# EAGLE design rly410 (EAGLE 6.5.0)
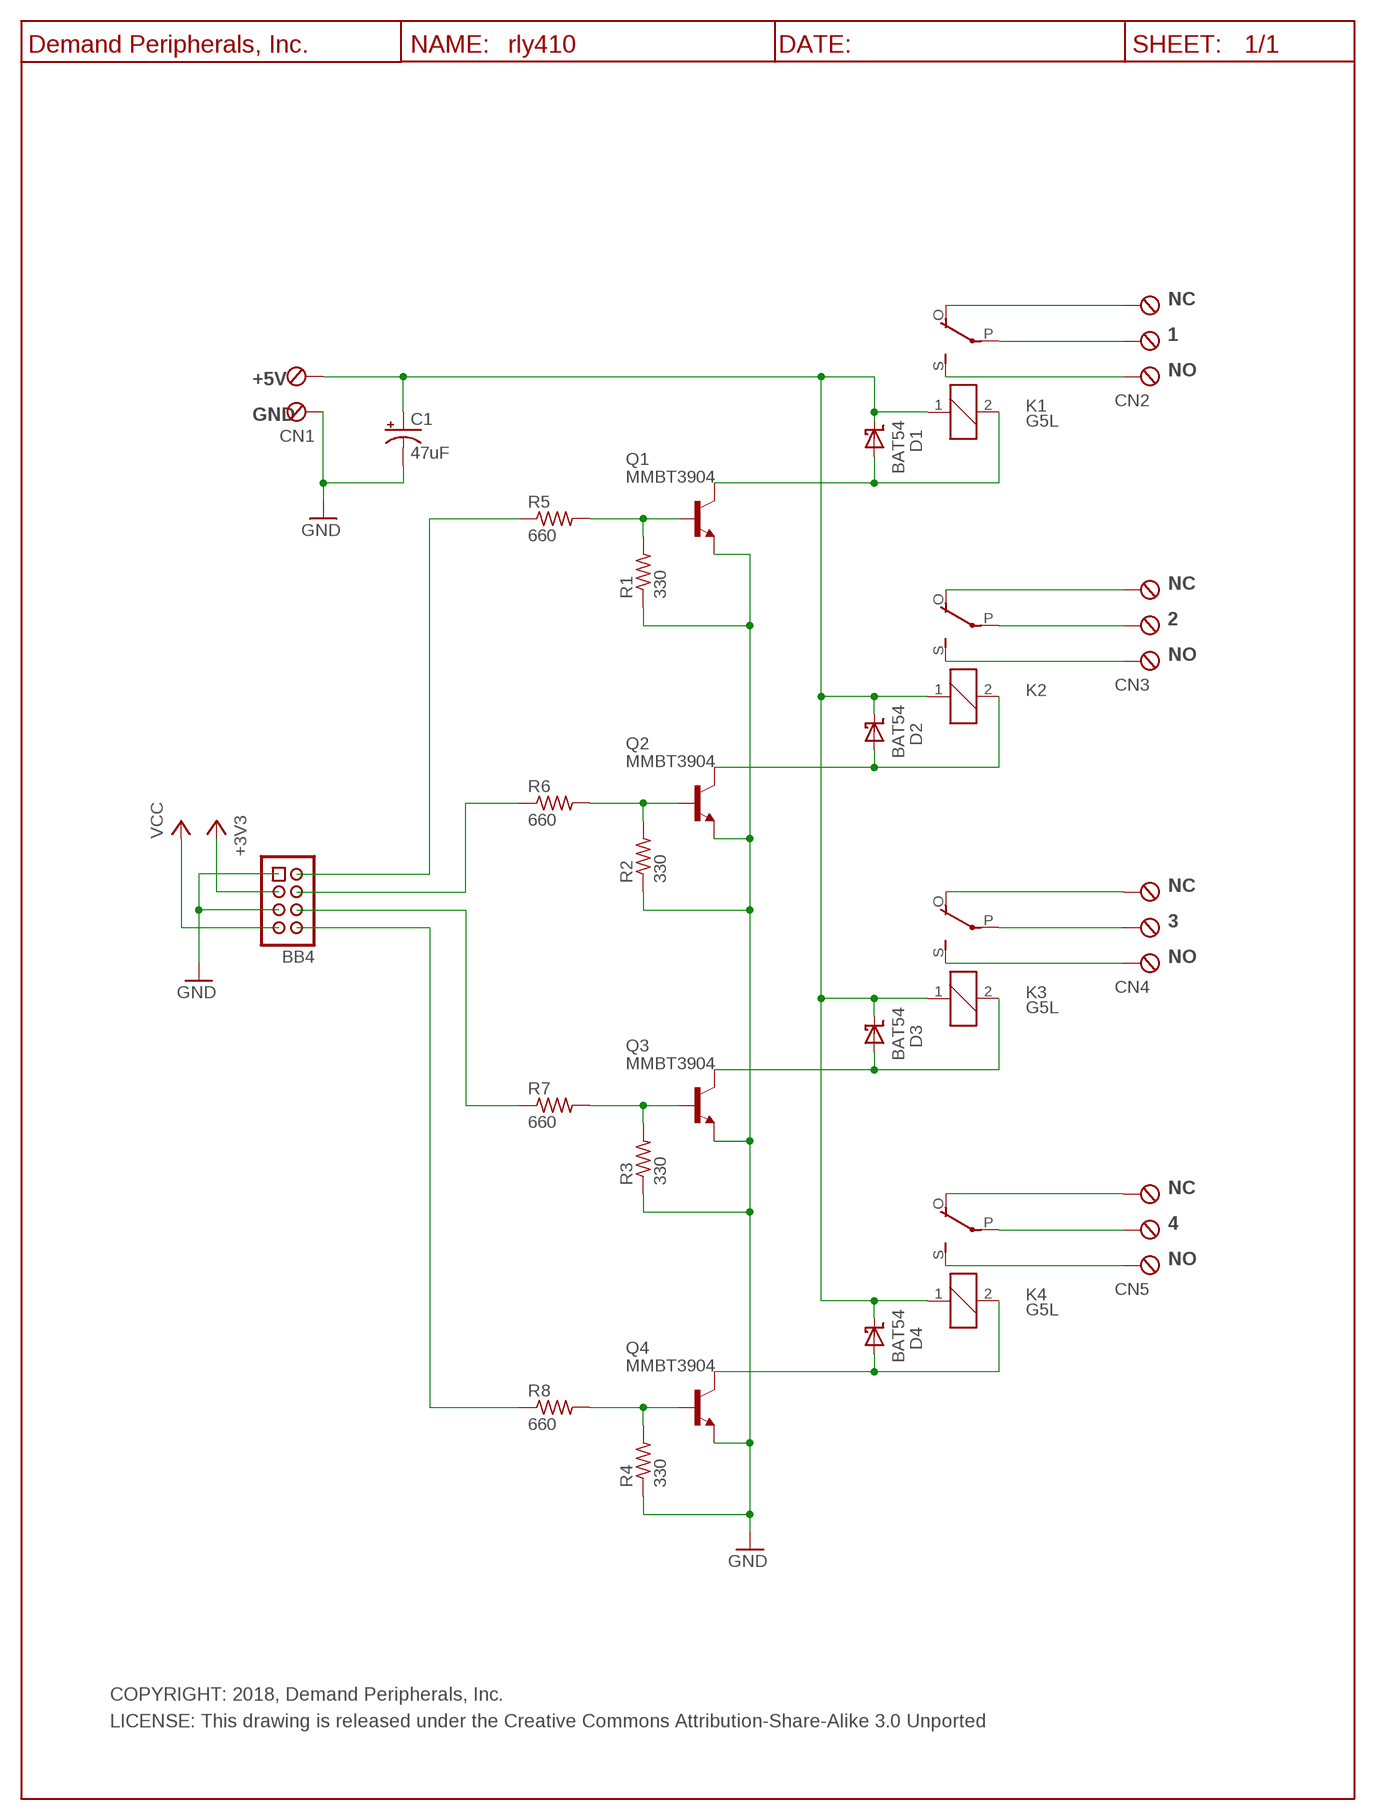
[diagram p0: schematic, sheet 1]

## Parts
BB4  Keyed_Pin_Header_4x2(0.1"x0.1")  HDR-4X2-SHR  [HDR-4X2]
C1  47uF  C100UF_E3.5-8  [E3.5-8]
CN1  TBLK-5.08-X2  [TBLK-5.08-X2]
CN2  TBLK-5.08-X3  [TBLK-5.08-X3]
CN3  TBLK-5.08-X3  [TBLK-5.08-X3]
CN4  TBLK-5.08-X3  [TBLK-5.08-X3]
CN5  TBLK-5.08-X3  [TBLK-5.08-X3]
D1  BAT54  [SOT23]
D2  BAT54  [SOT23]
D3  BAT54  [SOT23]
D4  BAT54  [SOT23]
K1  G5L  [G5LE]
K2  G5L  [G5LE]
K3  G5L  [G5LE]
K4  G5L  [G5LE]
Q1  MMBT3904  [SOT23]
Q2  MMBT3904  [SOT23]
Q3  MMBT3904  [SOT23]
Q4  MMBT3904  [SOT23]
R1  330  R360_R0603  [R0603]
R2  330  R360_R0603  [R0603]
R3  330  R360_R0603  [R0603]
R4  330  R360_R0603  [R0603]
R5  660  R660_R0603  [R0603]
R6  660  R660_R0603  [R0603]
R7  660  R660_R0603  [R0603]
R8  660  R660_R0603  [R0603]
U$1  DP_FRAME_P  [P_FRAME]

## Nets
+3V3: BB4.3
GND: BB4.1 BB4.5 C1.- CN1.1(KL) Q1.2(E) Q2.2(E) Q3.2(E) Q4.2(E) R1.1 R2.1 R3.1 R4.1
N$1: CN4.3(KL2) K3.O(2:O)
N$2: BB4.2 R5.1
N$3: CN5.1(KL) K4.S(2:S)
N$4: BB4.4 R6.1
N$5: BB4.6 R7.1
N$6: Q4.1(B) R4.2 R8.2
N$7: C1.+ CN1.2(KL1) D1.3(CC) D2.3(CC) D3.3(CC) D4.3(CC) K1.1 K2.1 K3.1 K4.1
N$8: Q3.1(B) R3.2 R7.2
N$9: D1.1(A) K1.2 Q1.3(C)
N$10: D2.1(A) K2.2 Q2.3(C)
N$11: D3.1(A) K3.2 Q3.3(C)
N$12: D4.1(A) K4.2 Q4.3(C)
N$13: Q2.1(B) R2.2 R6.2
N$14: BB4.8 R8.1
N$15: Q1.1(B) R1.2 R5.2
N$21: CN5.3(KL2) K4.O(2:O)
N$22: CN5.2(KL1) K4.P(2:P)
N$25: CN4.2(KL1) K3.P(2:P)
N$26: CN4.1(KL) K3.S(2:S)
N$27: CN3.2(KL1) K2.P(2:P)
N$28: CN3.3(KL2) K2.O(2:O)
N$29: CN3.1(KL) K2.S(2:S)
N$30: CN2.2(KL1) K1.P(2:P)
N$31: CN2.3(KL2) K1.O(2:O)
N$32: CN2.1(KL) K1.S(2:S)
VCC: BB4.7

## Notes on the sheet
- NC
- 1
- NO
- +5V
- GND
- NC
- 2
- NO
- NC
- 3
- NO
- NC
- 4
- NO
- COPYRIGHT: 2018, Demand Peripherals, Inc.
- LICENSE: This drawing is released under the Creative Commons Attribution-Share-Alike 3.0 Unported

## Library data of the parts
BB4 = dpi-conn:HDR-4X2-SHR: Shrouded 4x2 pin header; VENDOR: Digikey; VENDOR-PART-NUM: 609-3530-ND
C1 = dpi-passive:C100UF_: 100uF polarized capacitor, general purpose; VENDOR: Digikey; VENDOR-PART-NUM: 1572-1044-ND
CN1 = dpi-conn:TBLK-5.08-X2: Terminal Block, 5.08mm, x2, screw terminals; VENDOR: Digikey; VENDOR-PART-NUM: ED2609-ND
CN2-CN5 = dpi-conn:TBLK-5.08-X3: Terminal Block, 5.08mm, x3, screw terminals; VENDOR: Digikey; VENDOR-PART-NUM: ED2610-ND
D1-D4 = dpi-diopto:BAT54: Schottky Diode; VENDOR: Digikey; VENDOR-PART-NUM: DB3Y313KELCT-ND
K1-K4 = dpi-swsens:G5L: Omron G5LE-14, SPDT, 10A AC, 5volt coil; VENDOR: Digikey; VENDOR-PART-NUM: Z1011-ND
Q1-Q4 = dpi-transic:MMBT3904: 2N3904 NPN in SOT23; VENDOR: Digikey; VENDOR-PART-NUM: MMBT3904TPMSCT-ND
R1-R4 = dpi-passive:R360_: 360 Ohm resistor, 1%, 0.1 watt; VENDOR: Digikey; VENDOR-PART-NUM: 311-360HRTR-ND
R5-R8 = dpi-passive:R660_: 660 Ohm resistor, 1%, 0.1 watt; VENDOR: Digikey; VENDOR-PART-NUM: 311-660HRTR-ND
U$1 = dpi-sym:DP_FRAME_P: Portrait/Letter Document Frame

## Board
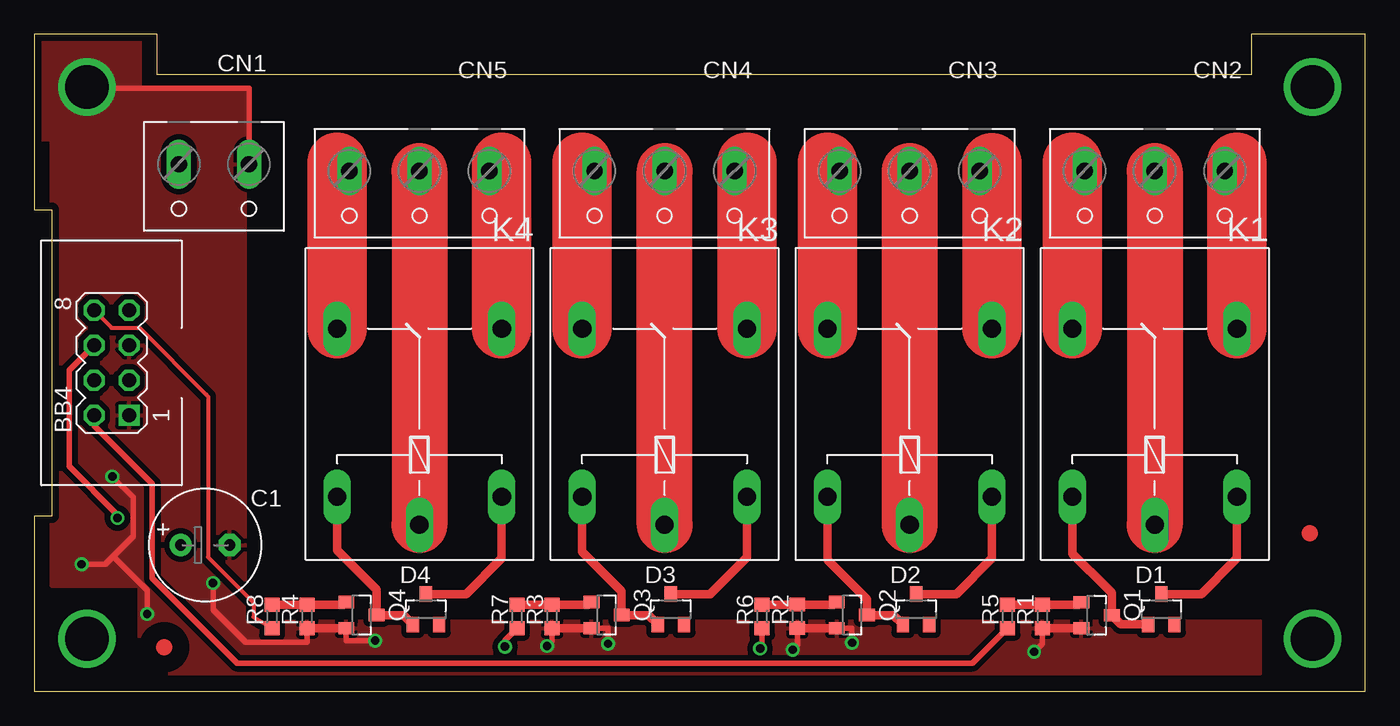
[diagram p1: board, top side]
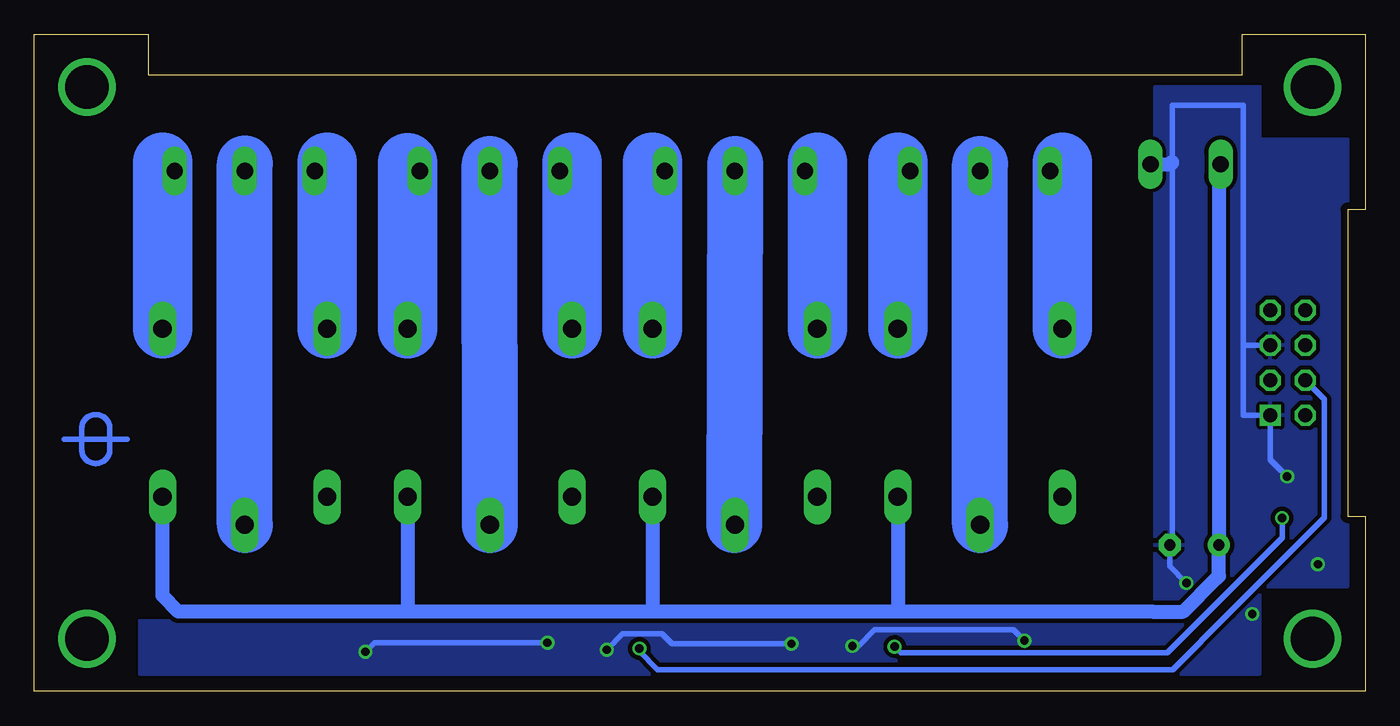
[diagram p2: board, bottom side, seen from below]

Size 96.52 x 47.62 mm. Coordinates in mm from the lower left corner, seen from the top.
Outline: 0,0 96.52,0 96.52,47.62 88.27,47.62 88.27,44.7 8.89,44.7 8.89,47.62 0,47.62 0,34.92 1.27,34.92 1.27,12.7 0,12.7 0,0
Copper layers (1*16): Top 0.035mm / dielectric 1.5mm / Bottom 0.035mm
Design rules "default *": minimum track width 10mil, minimum drill 20mil, track to track 2mil, track to pad 10mil, pad to pad 10mil, via to via 10mil, smd to smd 10mil, copper to edge 20mil, drill to drill 12mil, minimum pad ring 10mil, minimum via ring 8mil, stop-mask expansion 4mil, vias tented up to drill 30mil, thermal gap 10mil
tKeepout: area 1,15.1 to 9.7,32.5; area -2.5,-2.5 to -2.4,-2.4

### Footprints (pad centres in the part's own frame; a part is rotated, then mirrored left to right if it is on the bottom)
HDR-4X2 = drill 1.016 square: 1 -3.81,-1.27 | drill 1.016 octagon: 2 -3.81,1.27; 3 -1.27,-1.27; 4 -1.27,1.27; 5 1.27,-1.27; 6 1.27,1.27; 7 3.81,-1.27; 8 3.81,1.27
E3.5-8 = drill 0.813 pad 1.6: + -1.778,0 | drill 0.813 pad 1.6 octagon: - 1.778,0
TBLK-5.08-X2 = drill 1.194 long: 1 -2.54,-0.127; 2 2.54,-0.127
TBLK-5.08-X3 = drill 1.194 long: 1 -5.08,-0.127; 2 0,-0.127; 3 5.08,-0.127
SOT23 = smd 0.889 x 1.143: 1 -0.95,-1.1; 2 0.95,-1.1; 3 0,1.1
G5LE = drill 1.321 long: 1 -7.493,-5.969; 2 -7.493,5.969; O 4.699,5.969; P -9.525,0; S 4.699,-5.969
R0603 = smd 1 x 1.1: 1 -0.85,0; 2 0.85,0

### Placement (x,y rotation side)
BB4  5.59,23.81 90 top
C1  12.38,10.6 0 top
CN1  13.02,38.09 180 top
CN2  81.27,37.59 180 top
CN3  63.49,37.59 180 top
CN4  45.71,37.59 180 top
CN5  27.93,37.59 180 top
D1  81.74,5.94 0 top
D2  63.96,5.94 0 top
D3  46.16,5.94 0 top
D4  28.4,5.94 0 top
K1  81.27,21.59 90 top
K2  63.49,21.59 90 top
K3  45.71,21.59 90 top
K4  27.93,21.59 90 top
Q1  77.05,5.51 270 top
Q2  59.3,5.52 270 top
Q3  41.5,5.52 270 top
Q4  23.72,5.52 270 top
R1  73.11,5.42 90 top
R2  55.33,5.44 90 top
R3  37.54,5.42 90 top
R4  19.77,5.42 90 top
R5  70.57,5.42 90 top
R6  52.78,5.42 90 top
R7  35,5.42 90 top
R8  17.23,5.42 90 top
U$1  83.02,43.74 270 top
U$2  [DPI-1]  92.08,18.29 90 bottom
U$4  [FIDUCIAL]  9.4,3.19 90 top
U$5  [FIDUCIAL]  92.52,11.47 0 top

### Tracks (layer width: path | path; a pad name or v marks a point on that pad's centre or on a via)
GND  (via drill 0.6, 3.17 pad 3.17)
  Top 0.406: CN1.1 15.56,43.73 4.66,43.73 3.9,43.73 v3.81,43.81 | R4.1 19.77,3.54 15.32,3.54 12.95,5.91 v12.95,7.85 | v37.19,3.28 37.54,3.63 R3.1 | Q3.2 41.6,4.57 v41.6,3.44 | v55,3.01 55.33,3.34 R2.1 | Q2.2 59.31,4.57 v59.31,3.52 | v72.52,2.86 73.11,3.45 R1.1 | Q4.2 22.62,3.67 v24.71,3.67 | v5.65,15.57 7.16,14.06 7.16,11.24 5.81,9.89 | 5.81,9.89 5.13,9.21 v3.42,9.21 | v8.18,5.6 8.18,7.34 6.97,8.51 5.81,9.67 5.81,9.89
  Top 0.61: Q1.2 75.94,4.57 R1.1 | Q2.2 58.19,4.59 R2.1 | Q3.2 R3.1 | Q4.2 R4.1
  Bottom 0.406: 8.81,25.2 8.81,20 BB4.1 6.86,16.78 v5.65,15.57 | 8.81,25.2 8.81,42.48 13.99,42.48 13.99,38.96 | 13.99,38.96 13.99,38.39 | 13.99,38.39 13.99,38.28 | BB4.5 8.81,25.08 8.81,25.2 | 13.99,38.39 13.99,10.6 C1.- 14.16,9.05 v12.95,7.85 | 13.99,38.39 13.99,38.96 | v41.6,3.44 50.27,3.44 50.99,4.17 53.85,4.17 v55,3.01 | v59.31,3.52 71.86,3.52 v72.52,2.86 | v24.71,3.67 25.5,4.46 35.57,4.46 36.75,3.28 v37.19,3.28
  Bottom 1.016: CN1.1 14.17,38.21 arc-90 13.99,38.39
  pour Top (isolate 0.406): 1.27,7.62 1.27,40.01 0.51,40.01 0.51,47.12 7.62,47.12 7.62,43.81 15.24,43.81 15.24,5.08 88.9,5.08 88.9,1.27 7.62,1.27 7.62,7.62
  pour Bottom (isolate 0.305): 1.27,7.62 1.27,40.01 7.62,40.01 7.62,43.81 15.24,43.81 15.24,5.08 88.9,5.08 88.9,1.27 7.62,1.27 7.62,7.62
MOUNT0  (via drill 3.17 pad 3.17)
  other vias: 3.81,3.81
MOUNT6  (via drill 3.17 pad 3.17)
  other vias: 92.71,3.81
MOUNT7  (via drill 3.17 pad 3.17)
  other vias: 92.71,43.81
N$1
  Top 0.406: 39.74,26.38 CN4.3
  Top 4.318: K3.O 39.74,26.38 39.74,38.35
  Bottom 4.318: K3.O 39.74,38.35
N$2
  Top 0.406: R5.1 68.05,2.04 14.69,2.04 8.55,8.19 8.55,15.04 8.13,15.46 4.32,19.27 BB4.2
N$3
  Top 0.406: K4.S CN5.1
  Top 4.318: K4.S 33.9,38.35
  Bottom 4.318: K4.S 33.9,38.35
N$4  (via drill 0.6)
  Top 0.406: v52.64,3.1 52.78,3.24 R6.1
  Bottom 0.406: BB4.4 2.95,21.17 2.95,18.82 2.95,12.59 9.8,5.73 13.96,1.57 51.33,1.57 52.64,2.88 v52.64,3.1
N$5  (via drill 0.6)
  Top 0.406: BB4.6 2.53,23.29 2.53,16.31 6.02,12.81 v6.02,12.56 | v34.12,3.24 34.12,3.7 R7.1
  Bottom 0.406: v6.02,12.56 6.02,11.11 14.35,2.78 33.67,2.78 v34.12,3.24
N$6
  Top 0.61: Q4.1 22.42,6.27 R4.2 R8.2
N$7
  Top 0.61: D2.3 66.83,7.04 66.87,7.04 69.46,9.63 K2.1 | D1.3 84.63,7.04 87,9.41 87.24,9.65 K1.1 | D3.3 49.04,7.04 49.04,7.08 51.68,9.72 K3.1 | D4.3 30.82,7.04 31.31,7.04 33.9,9.63 K4.1
  Bottom 1.016: CN1.2 10.6,38.09 C1.+ 10.6,8.37 10.78,8.19 13.2,5.78 15.43,5.78 34.02,5.78 | 34.02,5.78 52.05,5.78 | 52.05,5.78 69.8,5.78 | 69.8,5.78 86.08,5.78 87.24,6.93 K1.1 | K2.1 69.46,5.78 69.8,5.78 | K3.1 51.68,5.78 52.05,5.78 | K4.1 33.9,5.78 34.02,5.78
N$8
  Top 0.61: Q3.1 40.2,6.27 R3.2 R7.2
N$9
  Top 0.61: K1.2 75.3,9.98 77.9,7.38 78.15,7.13 Q1.3 78.82,4.84 D1.1
N$10
  Top 0.61: K2.2 57.52,9.55 58.22,8.85 60.4,6.67 Q2.3 62.33,5.52 D2.1
N$11
  Top 0.61: K3.2 39.74,10.12 40.27,9.59 42.6,7.26 Q3.3 44.53,5.52 D3.1
N$12
  Top 0.61: K4.2 21.96,10.22 23.89,8.29 24.82,7.36 Q4.3 26.77,5.52 D4.1
N$13
  Top 0.61: Q2.1 58.01,6.29 R2.2 55.32,6.27 R6.2
N$14
  Top 0.305: BB4.8 5.59,26.35 7.62,26.35 12.47,21.5 12.59,21.39 12.59,9.73 15.9,6.41 15.9,5.37 R8.1
N$15
  Top 0.61: Q1.1 75.76,6.27 R1.2 R5.2
N$21
  Top 0.406: K4.O CN5.3
  Top 4.318: K4.O 21.96,38.35
  Bottom 4.318: K4.O 21.96,38.35
N$22
  Top 4.064: CN5.2 K4.P
  Bottom 4.064: K4.P 27.93,38.24
N$25
  Top 4.064: K3.P CN4.2
  Bottom 0.254: 45.68,38.24 45.68,37.72 CN4.2
  Bottom 4.064: 45.76,12.06 45.68,38.24
N$26
  Top 0.406: K3.S CN4.1
  Top 4.318: K3.S 51.68,38.35
  Bottom 4.318: K3.S 51.68,38.35
N$27
  Top 4.064: CN3.2 K2.P
  Bottom 4.064: K2.P 63.5,38.24
N$28
  Top 0.406: K2.O CN3.3
  Top 4.318: K2.O 57.52,38.35
  Bottom 4.318: K2.O 57.52,38.35
N$29
  Top 4.318: K2.S 69.46,38.34
  Bottom 1.27: 69.46,38.34 CN3.1
  Bottom 4.318: K2.S 69.46,38.34
N$30
  Top 4.064: CN2.2 K1.P
  Bottom 4.064: K1.P 81.25,38.27
N$31
  Top 0.406: K1.O CN2.3 | 75.3,38.35 76.21,37.71
  Top 4.318: K1.O 75.3,38.35
  Bottom 4.318: K1.O 75.3,38.35
N$32
  Top 0.406: K1.S CN2.1 | 87.24,38.35 86.37,37.69
  Top 4.318: K1.S 87.24,38.35
  Bottom 4.318: K1.S 87.24,38.35

### Text on the board
tTest: 3.8 Inches | 3.5 Inches | NC | 4 | NO | NC | 3 | NO | NC | 2 | NO | NC | 1 | NO | +5V | Gnd | BB4 | RLY410, Rev 18a | 1.575 Inches | 1.875 Inches | + | K4 | K3 | K2 | K1 | C1 | R4 | Q4 | R3 | Q3 | R2 | Q2 | R1 | Q1 | D4 | D3 | D2 | R8 | R7 | R6 | R5 | D1 | (C) 2018, Demand Peripherals, Inc.